# EAGLE design 1750_master_lcd (EAGLE 7.7.0)
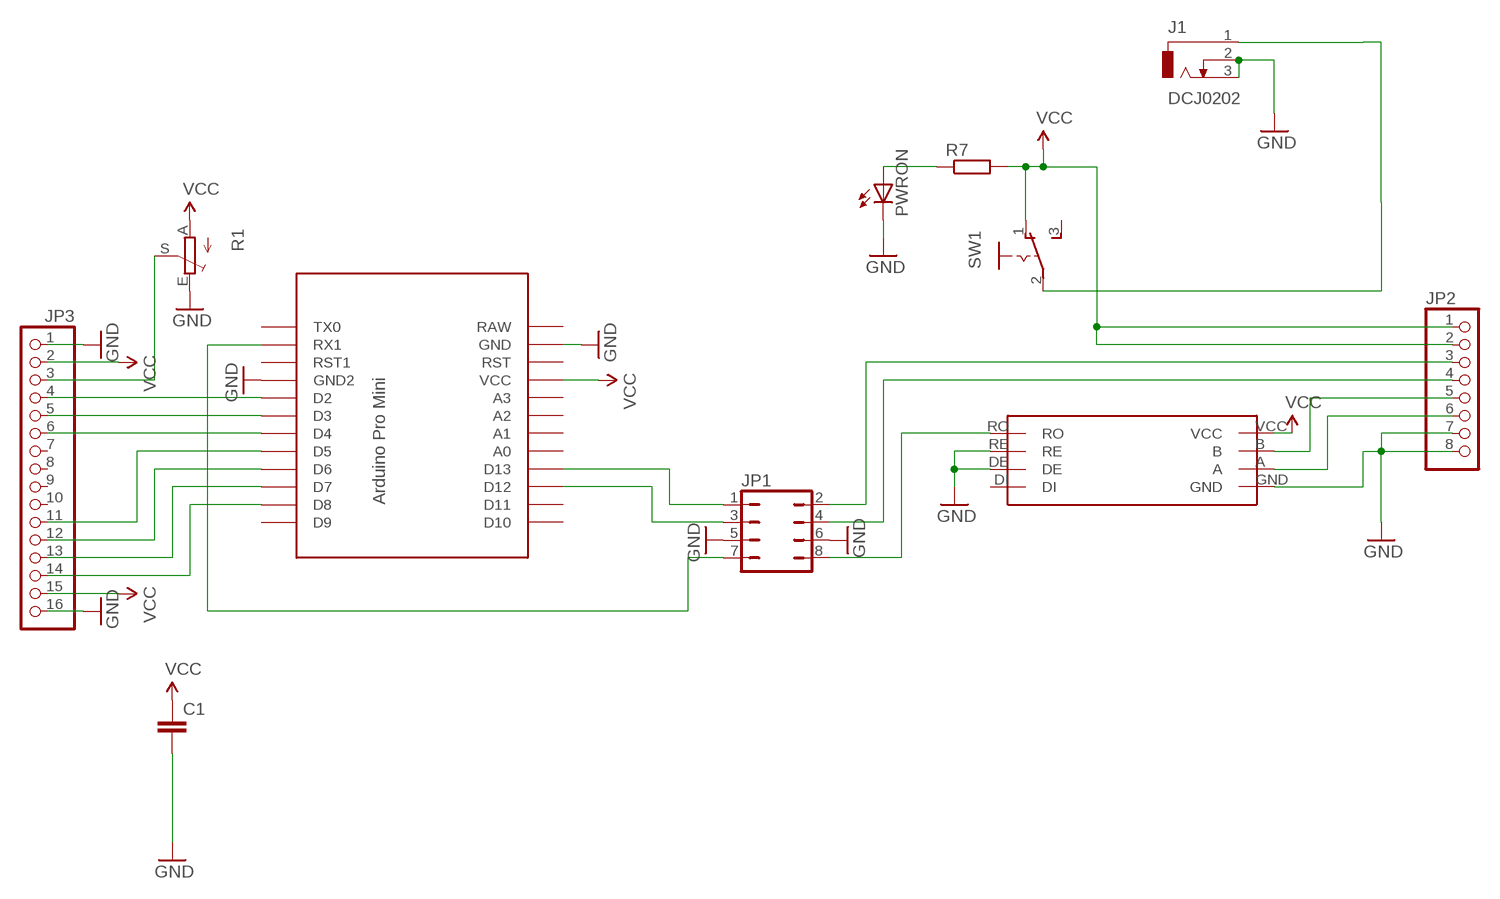
[diagram p0: schematic, sheet 1]

## Parts
C1  C-EU025-025X050  [C025-025X050]
J1  DCJ0202  [DCJ0202]
JP1  JP4Q  [JP4Q]
JP2  PINHD-1X8  [1X08]
JP3  PINHD-1X16  [1X16]
PWRON  LED5MM  [LED5MM]
R1  TRIM_EU-CA6V  [CA6V]
R7  R-EU_0207/10  [0207/10]
SW1  255SB  [255SB]
U$2  485F  [485F]
U$3  PRO-MINI-F  [PRO-MINI-F]

## Nets
GND: C1.2 J1.2 J1.3 JP1.5 JP1.6 JP2.7 JP2.8 JP3.1 JP3.16 PWRON.K(C) R1.E U$2.DE U$2.GND U$2.RE U$3.GND U$3.GND1(GND2)
N$1: JP2.5 U$2.B
N$2: JP2.6 U$2.A
N$3: JP1.4 JP2.4
N$4: JP1.2 JP2.3
N$5: J1.1 SW1.2(P)
N$6: JP1.8 U$2.RO
N$7: JP1.7 U$3.RX1
N$8: JP1.1 U$3.D13
N$9: JP1.3 U$3.D12
N$11: JP3.3 R1.S
N$12: JP3.4 U$3.D2
N$13: JP3.5 U$3.D3
N$14: JP3.6 U$3.D4
N$15: JP3.11 U$3.D5
N$16: JP3.12 U$3.D6
N$17: JP3.13 U$3.D7
N$18: JP3.14 U$3.D8
N$19: PWRON.A R7.1
VCC: C1.1 JP2.1 JP2.2 JP3.2 JP3.15 R1.A R7.2 SW1.1(O) U$2.VCC U$3.VCC
Unconnected: JP3.7 JP3.8 JP3.9 JP3.10 SW1.3(S) U$2.DI U$3.A0 U$3.A1 U$3.A2 U$3.A3 U$3.D9 U$3.D10 U$3.D11 U$3.RAW U$3.RST U$3.RST1 U$3.TX0

## Library data of the parts
C1 = resistor:C-EU: CAPACITOR, European symbol
J1 = con-jack:DCJ0202: DC POWER JACK Source: DCJ0202.pdf; OC_FARNELL: unknown; OC_NEWARK: unknown
JP1 = jumper:JP4Q: JUMPER
JP2 = pinhead:PINHD-1X8: PIN HEADER
JP3 = pinhead:PINHD-1X16: PIN HEADER
PWRON = led:LED: LED OSRAM: - CHIPLED LG R971, LG N971, LY N971, LG Q971, LY Q971, LO R971, LY R971 LH N974, LH R974 LS Q976, LO Q976, LY Q976 LO Q996 - Hyper CHIPLED LW Q18S LB Q993, LB Q99A, LB R99A - SideLED LS A670, LO A670, LY A670, LG A670, LP A670 LB A673, LV A673, LT A673, LW A673 LH A674 LY A675 LS A676, LA A676, LO A676, LY A676, LW A676 LS A679, LY A679, LG A679 - Hyper Micro SIDELED® LS Y876, LA Y876, LO Y876, LY Y876 LT Y87S - SmartLED LW L88C, LW L88S LB L89C, LB L89S, LG L890 LS L89K, LO L89K, LY L89K LS L896, LA L896, LO L896, LY L896 - TOPLED LS T670, LO T670, LY T670, LG T670, LP T670 LSG T670, LSP T670, LSY T670, LOP T670, LYG T670 LG T671, LOG T671, LSG T671 LB T673, LV T673, LT T673, LW T673 LH T674 LS T676, LA T676, LO T676, LY T676, LB T676, LH T676, LSB T676, LW T676 LB T67C, LV T67C, LT T67C, LS T67K, LO T67K, LY T67K, LW E67C LS E67B, LA E67B, LO E67B, LY E67B, LB E67C, LV E67C, LT E67C LW T67C LS T679, LY T679, LG T679 LS T770, LO T770, LY T770, LG T770, LP T770 LB T773, LV T773, LT T773, LW T773 LH T774 LS E675, LA E675, LY E675, LS T675 LS T776, LA T776, LO T776, LY T776, LB T776 LHGB T686 LT T68C, LB T68C - Hyper Mini TOPLED® LB M676 - Mini TOPLED Santana® LG M470 LS M47K, LO M47K, LY M47K Source: http://www.osram.convergy.de LUXEON: - LUMILED® LXK2-PW12-R00, LXK2-PW12-S00, LXK2-PW14-U00, LXK2-PW14-V00 LXK2-PM12-R00, LXK2-PM12-S00, LXK2-PM14-U00 LXK2-PE12-Q00, LXK2-PE12-R00, LXK2-PE12-S00, LXK2-PE14-T00, LXK2-PE14-U00 LXK2-PB12-K00, LXK2-PB12-L00, LXK2-PB12-M00, LXK2-PB14-N00, LXK2-PB14-P00, LXK2-PB14-Q00 LXK2-PR12-L00, LXK2-PR12-M00, LXK2-PR14-Q00, LXK2-PR14-R00 LXK2-PD12-Q00, LXK2-PD12-R00, LXK2-PD12-S00 LXK2-PH12-R00, LXK2-PH12-S00 LXK2-PL12-P00, LXK2-PL12-Q00, LXK2-PL12-R00 Source: www.luxeon.com KINGBRIGHT: KA-3528ASYC Source: www.kingbright.com
R1 = pot:TRIM_EU-: POTENTIOMETER
R7 = resistor:R-EU_: RESISTOR, European symbol
SW1 = switch:255SB: SLIDING SWITCH Distributor Buerklin, 11G810
U$2 = rs232-rs485:485F
U$3 = Arduino-clone:PRO-MINI-F: Arduino Pro Mini Layout 2 Sparkfun.com

## Board
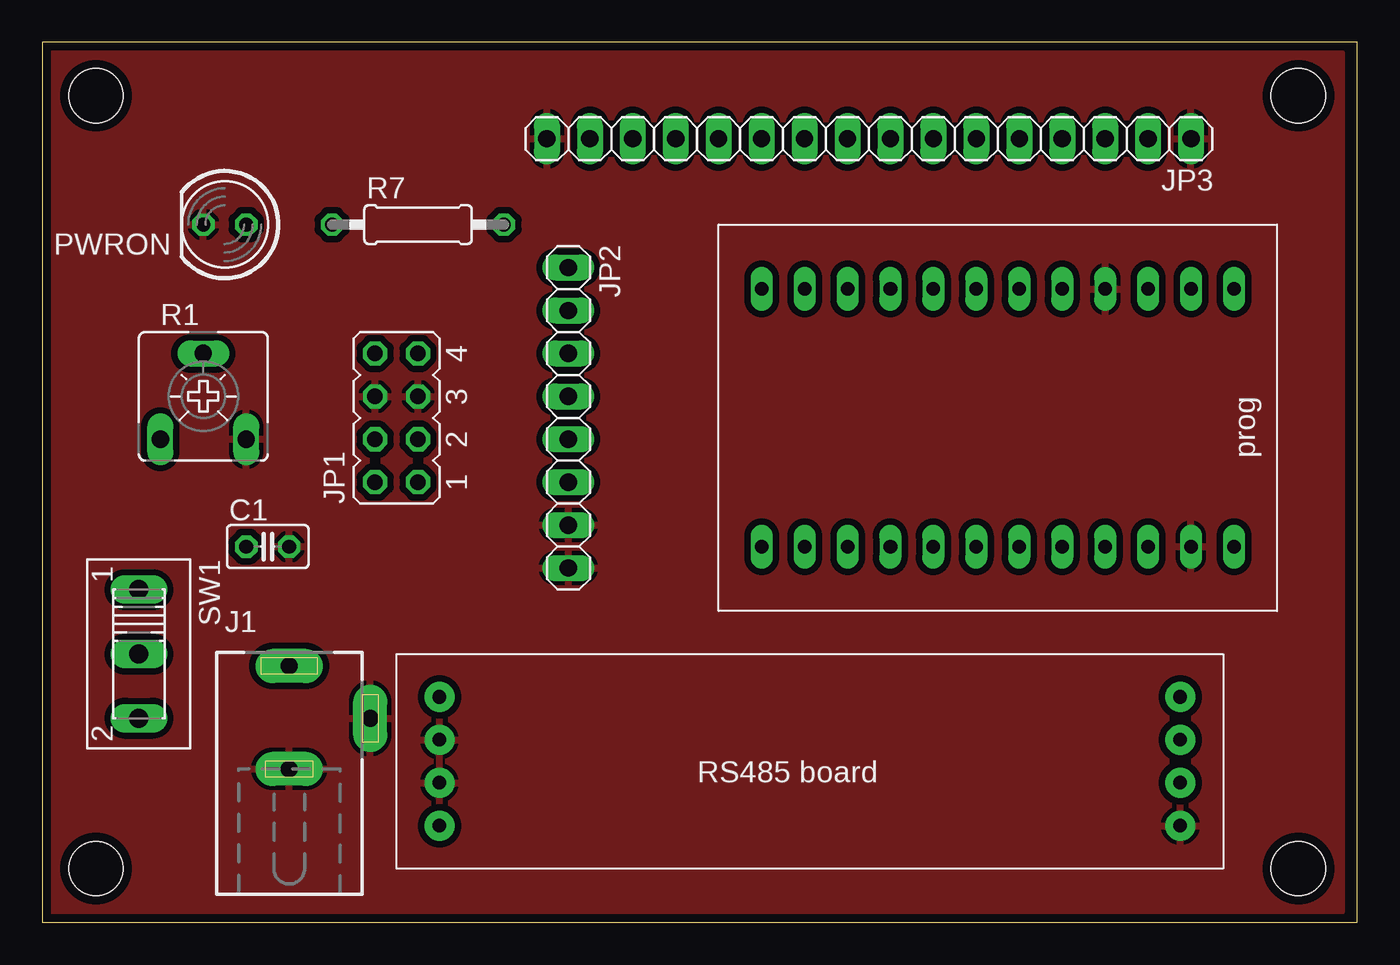
[diagram p1: board, top side]
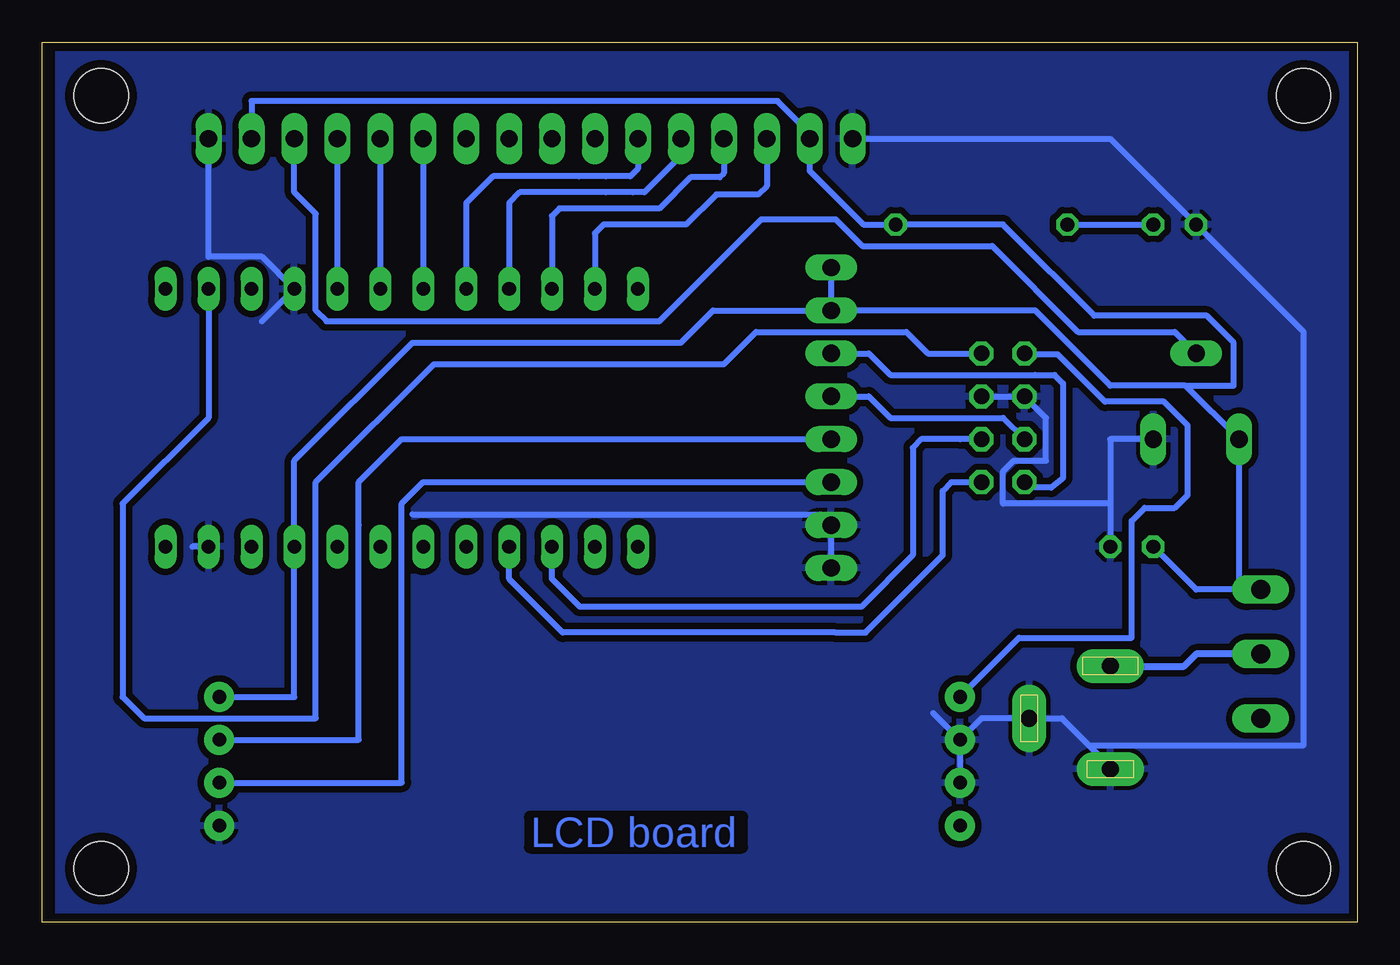
[diagram p2: board, bottom side, seen from below]

Size 77.77 x 52.06 mm. Coordinates in mm from the lower left corner, seen from the top.
Outline: 0,0 77.77,0 77.77,52.06 0,52.06 0,0
Copper layers (1*16): Top 0.035mm / dielectric 1.5mm / Bottom 0.035mm
Design rules "ff": minimum track width 14mil, minimum drill 24mil, track to track 15mil, track to pad 15mil, pad to pad 8mil, via to via 8mil, smd to smd 8mil, copper to edge 20mil, drill to drill 8mil, minimum pad ring 10mil, minimum via ring 8mil, stop-mask expansion 4mil, vias tented up to drill 0mil, thermal gap 10mil
Holes 3.2 mm at 74.3,48.9 74.3,3.18 3.18,3.18 3.18,48.9

### Footprints (pad centres in the part's own frame; a part is rotated, then mirrored left to right if it is on the bottom)
C025-025X050 = drill 0.813 octagon: 1 -1.27,0; 2 1.27,0
DCJ0202 = drill 1 pad 2 long: 1 0,3.1; 2 4.8,0; 3 0,-3
JP4Q = drill 0.914 octagon: 1 -3.81,-1.27; 2 -3.81,1.27; 3 -1.27,-1.27; 4 -1.27,1.27; 5 1.27,-1.27; 6 1.27,1.27; 7 3.81,-1.27; 8 3.81,1.27
1X08 = drill 1.016 long: 1 -8.89,0; 2 -6.35,0; 3 -3.81,0; 4 -1.27,0; 5 1.27,0; 6 3.81,0; 7 6.35,0; 8 8.89,0
1X16 = drill 1.016 long: 1 -19.05,0; 2 -16.51,0; 3 -13.97,0; 4 -11.43,0; 5 -8.89,0; 6 -6.35,0; 7 -3.81,0; 8 -1.27,0; 9 1.27,0; 10 3.81,0; 11 6.35,0; 12 8.89,0; 13 11.43,0; 14 13.97,0; 15 16.51,0; 16 19.05,0
LED5MM = drill 0.813 octagon: A -1.27,0; K 1.27,0
CA6V = drill 1.016 long: A -2.54,-2.54; E 2.54,-2.54; S 0,2.54
0207/10 = drill 0.813 octagon: 1 -5.08,0; 2 5.08,0
255SB = drill 1.118 long: 1 -3.81,0; 2 0,0; 3 3.81,0
485F = drill 0.8 pad 1.778: A 26.035,5.08; B 26.035,7.62; DE -17.78,5.08; DI -17.78,2.54; GND 26.035,2.54; RE -17.78,7.62; RO -17.78,10.16; VCC 26.035,10.16
PRO-MINI-F = drill 0.8 long: A0 6.35,2.54; A1 6.35,0; A2 6.35,-2.54; A3 6.35,-5.08; D2 -8.89,2.54; D3 -8.89,0; D4 -8.89,-2.54; D5 -8.89,-5.08; D6 -8.89,-7.62; D7 -8.89,-10.16; D8 -8.89,-12.7; D9 -8.89,-15.24; D10 6.35,-15.24; D11 6.35,-12.7; D12 6.35,-10.16; D13 6.35,-7.62; GND 6.35,10.16; GND1 -8.89,5.08; RAW 6.35,12.7; RST 6.35,7.62; RST1 -8.89,7.62; RX1 -8.89,10.16; TX0 -8.89,12.7; VCC 6.35,5.08

### Placement (x,y rotation side)
C1  13.34,22.23 0 top
J1  14.61,12.06 0 top
JP1  20.96,29.84 90 top
JP2  31.11,29.84 270 top
JP3  48.89,46.36 180 top
PWRON  10.79,41.28 180 top
R1  9.52,31.12 0 top
R7  22.22,41.28 0 top
SW1  5.71,15.88 270 top
U$2  41.28,3.18 0 top
U$3  57.78,28.58 270 top

### Tracks (layer width: path | path; a pad name or v marks a point on that pad's centre or on a via)
GND
  Bottom 0.356: JP3.16 14.61,46.36 PWRON.K 3.18,34.93 3.18,10.48 15.88,10.48 | U$2.RE U$2.DE | 15.88,10.48 17.46,12.06 19.37,12.06 J1.2 19.68,12.06 22.22,12.06 U$2.RE | 15.88,10.48 14.61,9.21 J1.3 | JP1.5 JP1.6 18.42,29.84 18.42,27.3 20.32,27.3 20.96,26.67 20.96,24.77 14.61,24.77 | 14.61,24.77 14.61,28.58 R1.E | 14.61,24.77 C1.2 | 25.08,12.38 U$2.RE | JP2.8 JP2.7 31.75,24.13 55.88,24.13 | 64.77,35.56 U$3.GND1 64.77,39.37 67.94,39.37 JP3.1 | U$3.GND 68.9,22.23
  pour Bottom: 0.63,51.44 76.83,51.44 76.83,0.63 0.63,0.63
  pour Top: 0.63,51.44 76.83,51.44 76.83,0.63 0.63,0.63
N$1
  Bottom 0.356: U$2.B 59.05,10.79 59.05,23.5 59.05,26.04 56.52,28.58 JP2.5
N$2
  Bottom 0.356: U$2.A 56.52,8.26 56.52,24.77 55.24,26.04 JP2.6
N$3
  Bottom 0.356: JP1.4 20.96,29.84 27.62,29.84 28.89,31.12 JP2.4
N$4
  Bottom 0.356: JP1.2 19.37,25.72 18.1,25.72 17.46,26.23 17.4,26.29 17.4,31.88 17.91,32.39 19.05,32.39 27.62,32.39 28.89,33.66 JP2.3
N$5
  Bottom 0.406: SW1.2 9.52,15.88 10.29,15.11 14.55,15.11 J1.1
N$6
  Bottom 0.356: JP1.8 19.37,33.59 17.72,33.59 14.92,30.8 11.43,30.8 10.48,29.84 10.03,29.4 10.03,25.27 10.79,24.51 12.57,24.51 13.34,23.75 13.34,22.86 13.34,16.83 20,16.83 U$2.RO
N$7
  Bottom 0.356: U$3.RX1 67.94,29.84 73.02,24.77 73.02,13.33 71.75,12.06 61.59,12.06 61.59,26.04 54.61,33.02 50.16,33.02 38.1,33.02 37.47,33.02 35.56,34.93 26.67,34.93 25.4,33.66 JP1.7
N$8
  Bottom 0.356: U$3.D13 50.16,20.32 46.99,17.15 30.86,17.15 29.08,17.15 24.51,21.72 24.51,25.53 24,26.04 JP1.1
N$9
  Bottom 0.356: JP1.3 23.5,28.58 25.78,28.58 26.29,28.07 26.29,21.72 29.34,18.67 45.97,18.67 47.62,20.32 U$3.D12
N$11
  Bottom 0.356: R1.S 10.79,34.93 16.51,34.93 21.59,40.01 29.27,40.01 30.86,41.59 35.24,41.59 41.28,35.56 60.96,35.56 61.59,36.2 61.59,41.91 62.86,43.18 JP3.3
N$12
  Bottom 0.356: JP3.4 U$3.D2
N$13
  Bottom 0.356: JP3.5 U$3.D3
N$14
  Bottom 0.356: JP3.6 U$3.D4
N$15
  Bottom 0.356: JP3.11 42.55,46.04 42.55,44.58 42.8,44.32 42.99,44.13 44.45,44.13 46.04,44.13 51.12,44.13 52.7,42.55 U$3.D5
N$16
  Bottom 0.356: JP3.12 40,46.04 40,45.34 41.28,44.07 42.16,43.18 42.86,43.18 44.45,43.18 49.53,43.18 50.16,42.55 U$3.D6
N$17
  Bottom 0.356: JP3.13 37.47,46.04 37.47,44.32 37.72,44.07 39.43,44.07 41.28,42.23 42.86,42.23 47.18,42.23 47.62,41.78 U$3.D7
N$18
  Bottom 0.356: JP3.14 34.92,46.04 34.92,43.56 35.43,43.05 37.91,43.05 39.69,41.28 41.28,41.28 44.58,41.28 45.08,40.77 U$3.D8
N$19
  Bottom 0.356: R7.1 PWRON.A
VCC
  Bottom 0.356: JP3.2 65.41,48.58 34.29,48.58 32.39,46.67 JP3.15 32.39,46.04 32.39,44.45 31.75,43.82 29.21,41.28 R7.2 20.96,41.28 20.64,40.96 15.56,35.88 8.89,35.88 7.3,34.29 7.3,31.75 10.16,31.75 | U$2.VCC 62.86,13.33 U$3.VCC 62.86,27.3 55.88,34.29 52.7,34.29 40,34.29 38.1,36.2 JP2.2 | JP2.1 JP2.2 | C1.1 9.52,19.69 6.98,19.69 | 6.98,19.69 SW1.1 6.98,19.69 | 6.98,19.69 R1.A 10.16,31.75 | 10.16,31.75 14.61,31.75 19.05,36.2 JP2.2 | JP2.2 31.43,36.2

### Text on the board
Bottom: LCD board